# EAGLE design Rev A (EAGLE 6.5.0)

## Sheet 1 of 2
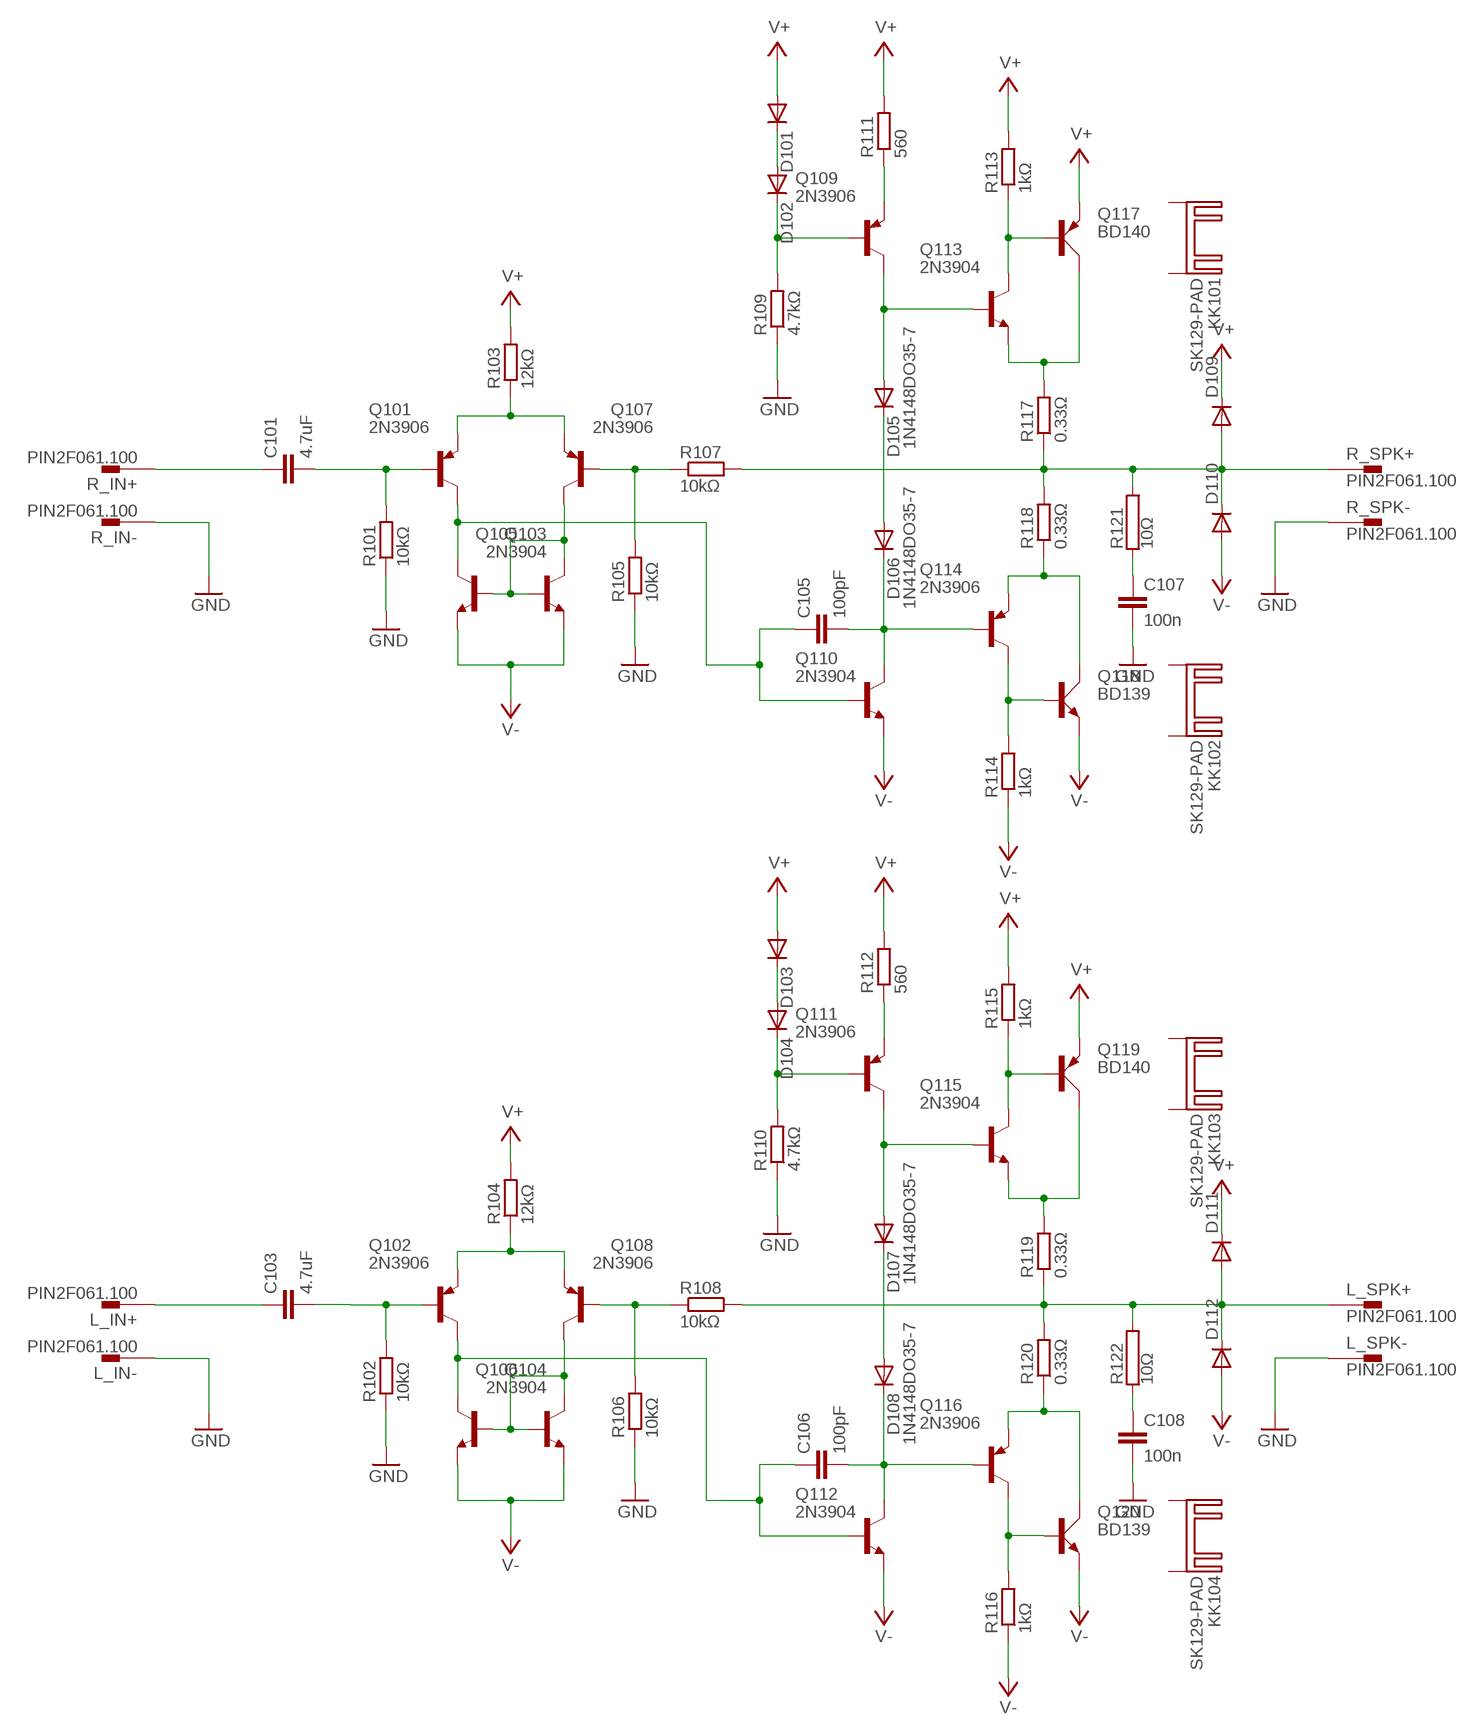
[diagram p0: schematic, sheet 1]

### Parts
C101  4.7uF  C-EU225-113X268  [C225-113X268]
C103  4.7uF  C-EU225-113X268  [C225-113X268]
C105  100pF  C-EU050-050X075  [C050-050X075]
C106  100pF  C-EU050-050X075  [C050-050X075]
C107  100n  C-EU075-042X103  [C075-042X103]
C108  100n  C-EU075-042X103  [C075-042X103]
D101  1N4148DO35-7  [DO35-7]
D102  1N4148DO35-7  [DO35-7]
D103  1N4148DO35-7  [DO35-7]
D104  1N4148DO35-7  [DO35-7]
D105  1N4148DO35-7  [DO35-7]
D106  1N4148DO35-7  [DO35-7]
D107  1N4148DO35-7  [DO35-7]
D108  1N4148DO35-7  [DO35-7]
D109  1N4148DO35-7  [DO35-7]
D110  1N4148DO35-7  [DO35-7]
D111  1N4148DO35-7  [DO35-7]
D112  1N4148DO35-7  [DO35-7]
KK101  SK129-PAD  [SK129]
KK102  SK129-PAD  [SK129]
KK103  SK129-PAD  [SK129]
KK104  SK129-PAD  [SK129]
L_IN+  PIN2F061.100  [F061.100]
L_IN-  PIN2F061.100  [F061.100]
L_SPK+  PIN2F061.100  [F061.100]
L_SPK-  PIN2F061.100  [F061.100]
Q101  2N3906  [TO92]
Q102  2N3906  [TO92]
Q103  2N3904  [TO92]
Q104  2N3904  [TO92]
Q105  2N3904  [TO92]
Q106  2N3904  [TO92]
Q107  2N3906  [TO92]
Q108  2N3906  [TO92]
Q109  2N3906  [TO92]
Q110  2N3904  [TO92]
Q111  2N3906  [TO92]
Q112  2N3904  [TO92]
Q113  2N3904  [TO92]
Q114  2N3906  [TO92]
Q115  2N3904  [TO92]
Q116  2N3906  [TO92]
Q117  BD140  [TO126AV]
Q118  BD139  [TO126AV]
Q119  BD140  [TO126AV]
Q120  BD139  [TO126AV]
R101  10kΩ  R-EU_0207/10  [0207/10]
R102  10kΩ  R-EU_0207/10  [0207/10]
R103  12kΩ  R-EU_0207/10  [0207/10]
R104  12kΩ  R-EU_0207/10  [0207/10]
R105  10kΩ  R-EU_0207/10  [0207/10]
R106  10kΩ  R-EU_0207/10  [0207/10]
R107  10kΩ  R-EU_0207/10  [0207/10]
R108  10kΩ  R-EU_0207/10  [0207/10]
R109  4.7kΩ  R-EU_0207/10  [0207/10]
R110  4.7kΩ  R-EU_0207/10  [0207/10]
R111  560  R-EU_0207/10  [0207/10]
R112  560  R-EU_0207/10  [0207/10]
R113  1kΩ  R-EU_0207/10  [0207/10]
R114  1kΩ  R-EU_0207/10  [0207/10]
R115  1kΩ  R-EU_0207/10  [0207/10]
R116  1kΩ  R-EU_0207/10  [0207/10]
R117  0.33Ω  R-EU_0309/12  [0309/12]
R118  0.33Ω  R-EU_0309/12  [0309/12]
R119  0.33Ω  R-EU_0309/12  [0309/12]
R120  0.33Ω  R-EU_0309/12  [0309/12]
R121  10Ω  RMNS-5  [MNS-5]
R122  10Ω  RMNS-5  [MNS-5]
R_IN+  PIN2F061.100  [F061.100]
R_IN-  PIN2F061.100  [F061.100]
R_SPK+  PIN2F061.100  [F061.100]
R_SPK-  PIN2F061.100  [F061.100]

### Nets
GND: C107.2 C108.2 L_IN-.A1 L_IN-.A2 L_SPK-.A1 L_SPK-.A2 R101.1 R102.1 R105.1 R106.1 R109.1 R110.1 R_IN-.A1 R_IN-.A2 R_SPK-.A1 R_SPK-.A2 ; also sheet 2
L_OUT: D111.A D112.C L_SPK+.A1 L_SPK+.A2 R108.2 R119.1 R120.2 R122.2
N$1: D105.A Q109.1(C) Q113.2(B)
N$2: Q101.3(E) Q107.3(E) R103.1
N$3: Q103.2(B) Q105.1(C) Q105.2(B) Q107.1(C)
N$4: Q104.2(B) Q106.1(C) Q106.2(B) Q108.1(C)
N$5: C101.2 Q101.2(B) R101.2
N$6: D102.C Q109.2(B) R109.2
N$7: C101.1 R_IN+.A1 R_IN+.A2
N$8: C105.1 Q101.1(C) Q103.1(C) Q110.2(B)
N$9: D101.C D102.A
N$11: Q109.3(E) R111.1
N$12: D104.C Q111.2(B) R110.2
N$13: D103.C D104.A
N$14: Q111.3(E) R112.1
N$15: C103.1 L_IN+.A1 L_IN+.A2
N$16: C107.1 R121.1
N$17: C108.1 R122.1
N$24: D105.C D106.A
N$25: C103.2 Q102.2(B) R102.2
N$26: Q113.1(C) Q117.B R113.1
N$27: Q114.1(C) Q118.B R114.2
N$28: Q114.3(E) Q118.C R118.1
N$29: Q113.3(E) Q117.C R117.2
N$31: C105.2 D106.C Q110.1(C) Q114.2(B)
N$32: Q107.2(B) R105.2 R107.1
N$33: Q102.3(E) Q108.3(E) R104.1
N$34: C106.1 Q102.1(C) Q104.1(C) Q112.2(B)
N$35: D107.C D108.A
N$36: D107.A Q111.1(C) Q115.2(B)
N$37: Q115.1(C) Q119.B R115.1
N$38: Q115.3(E) Q119.C R119.2
N$39: Q116.1(C) Q120.B R116.2
N$40: Q116.3(E) Q120.C R120.1
N$41: C106.2 D108.C Q112.1(C) Q116.2(B)
N$42: Q108.2(B) R106.2 R108.1
R_OUT: D109.A D110.C R107.2 R117.1 R118.2 R121.2 R_SPK+.A1 R_SPK+.A2
V+: D101.A D103.A D109.C D111.C Q117.E Q119.E R103.2 R104.2 R111.2 R112.2 R113.2 R115.2 ; also sheet 2
V-: D110.A D112.A Q103.3(E) Q104.3(E) Q105.3(E) Q106.3(E) Q110.3(E) Q112.3(E) Q118.E Q120.E R114.1 R116.1 ; also sheet 2
Unconnected: KK101.A2,5(K) KK101.B2,5(K) KK102.A2,5(K) KK102.B2,5(K) KK103.A2,5(K) KK103.B2,5(K) KK104.A2,5(K) KK104.B2,5(K)

## Sheet 2 of 2
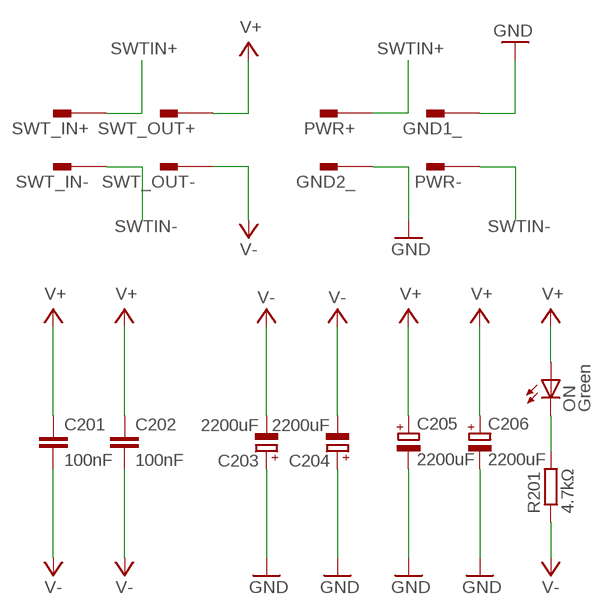
[diagram p1: schematic, sheet 2]

### Parts
C201  100nF  C-EU025-025X050  [C025-025X050]
C202  100nF  C-EU025-025X050  [C025-025X050]
C203  2200uF  CPOL-EUE5-10.5  [E5-10,5]
C204  2200uF  CPOL-EUE5-10.5  [E5-10,5]
C205  2200uF  CPOL-EUE5-10.5  [E5-10,5]
C206  2200uF  CPOL-EUE5-10.5  [E5-10,5]
GND1_  PIN2F061.100  [F061.100]
GND2_  PIN2F061.100  [F061.100]
ON  Green  LED5MM  [LED5MM]
PWR+  PIN2F061.100  [F061.100]
PWR-  PIN2F061.100  [F061.100]
R201  4.7kΩ  R-EU_0207/10  [0207/10]
SWT_IN+  PIN2F061.100  [F061.100]
SWT_IN-  PIN2F061.100  [F061.100]
SWT_OUT+  PIN2F061.100  [F061.100]
SWT_OUT-  PIN2F061.100  [F061.100]

### Nets
GND: C203.+ C204.+ C205.- C206.- GND1_.A1 GND1_.A2 GND2_.A1 GND2_.A2 ; also sheet 1
N$10: ON.K(C) R201.2
SWTIN+: PWR+.A1 PWR+.A2 SWT_IN+.A1 SWT_IN+.A2
SWTIN-: PWR-.A1 PWR-.A2 SWT_IN-.A1 SWT_IN-.A2
V+: C201.1 C202.1 C205.+ C206.+ ON.A SWT_OUT+.A1 SWT_OUT+.A2 ; also sheet 1
V-: C201.2 C202.2 C203.- C204.- R201.1 SWT_OUT-.A1 SWT_OUT-.A2 ; also sheet 1

## Library data of the parts
C101 C103 C105-C108 C201 C202 = rcl:C-EU: CAPACITOR, European symbol
C203-C206 = rcl:CPOL-EU: POLARIZED CAPACITOR, European symbol
D101-D112 = diode:1N4148: DIODE high speed (Philips)
GND1_ GND2_ L_IN+ L_IN- L_SPK+ L_SPK- PWR+ PWR- R_IN+ R_IN- R_SPK+ R_SPK- SWT_IN+ SWT_IN- SWT_OUT+ SWT_OUT- = con-faston:PIN2: Flachstecker Typ Tyco/Electronics/AMP TAB, FASTON Printed Circuit Board Tabs Source: http://www.buerklin.com, http://catalog.tycoelectronics.com; OC_FARNELL: unknown; OC_NEWARK: unknown
KK101-KK104 = heatsink:SK129-PAD: HEATSINK manufacturer Fischer/distributor Buerklin
ON = led:LED: LED OSRAM: - CHIPLED LG R971, LG N971, LY N971, LG Q971, LY Q971, LO R971, LY R971 LH N974, LH R974 LS Q976, LO Q976, LY Q976 LO Q996 - Hyper CHIPLED LW Q18S LB Q993, LB Q99A, LB R99A - SideLED LS A670, LO A670, LY A670, LG A670, LP A670 LB A673, LV A673, LT A673, LW A673 LH A674 LY A675 LS A676, LA A676, LO A676, LY A676, LW A676 LS A679, LY A679, LG A679 - Hyper Micro SIDELED® LS Y876, LA Y876, LO Y876, LY Y876 LT Y87S - SmartLED LW L88C, LW L88S LB L89C, LB L89S, LG L890 LS L89K, LO L89K, LY L89K LS L896, LA L896, LO L896, LY L896 - TOPLED LS T670, LO T670, LY T670, LG T670, LP T670 LSG T670, LSP T670, LSY T670, LOP T670, LYG T670 LG T671, LOG T671, LSG T671 LB T673, LV T673, LT T673, LW T673 LH T674 LS T676, LA T676, LO T676, LY T676, LB T676, LH T676, LSB T676, LW T676 LB T67C, LV T67C, LT T67C, LS T67K, LO T67K, LY T67K, LW E67C LS E67B, LA E67B, LO E67B, LY E67B, LB E67C, LV E67C, LT E67C LW T67C LS T679, LY T679, LG T679 LS T770, LO T770, LY T770, LG T770, LP T770 LB T773, LV T773, LT T773, LW T773 LH T774 LS E675, LA E675, LY E675, LS T675 LS T776, LA T776, LO T776, LY T776, LB T776 LHGB T686 LT T68C, LB T68C - Hyper Mini TOPLED® LB M676 - Mini TOPLED Santana® LG M470 LS M47K, LO M47K, LY M47K Source: http://www.osram.convergy.de LUXEON: - LUMILED® LXK2-PW12-R00, LXK2-PW12-S00, LXK2-PW14-U00, LXK2-PW14-V00 LXK2-PM12-R00, LXK2-PM12-S00, LXK2-PM14-U00 LXK2-PE12-Q00, LXK2-PE12-R00, LXK2-PE12-S00, LXK2-PE14-T00, LXK2-PE14-U00 LXK2-PB12-K00, LXK2-PB12-L00, LXK2-PB12-M00, LXK2-PB14-N00, LXK2-PB14-P00, LXK2-PB14-Q00 LXK2-PR12-L00, LXK2-PR12-M00, LXK2-PR14-Q00, LXK2-PR14-R00 LXK2-PD12-Q00, LXK2-PD12-R00, LXK2-PD12-S00 LXK2-PH12-R00, LXK2-PH12-S00 LXK2-PL12-P00, LXK2-PL12-Q00, LXK2-PL12-R00 Source: www.luxeon.com KINGBRIGHT: KA-3528ASYC Source: www.kingbright.com
Q101 Q102 Q107-Q109 Q111 Q114 Q116 = transistor-pnp:2N3906: PNP Transistor
Q103-Q106 Q110 Q112 Q113 Q115 = transistor-npn:2N3904: NPN Transistor
Q117 Q119 = transistor-power:BD140: PNP TRANSISTOR
Q118 Q120 = transistor-power:BD139: NPN TRANSISTOR
R101-R120 R201 = rcl:R-EU_: RESISTOR, European symbol
R121 R122 = resistor-power:R: Power Resitor; OC_FARNELL: unknown; OC_NEWARK: unknown

## Board
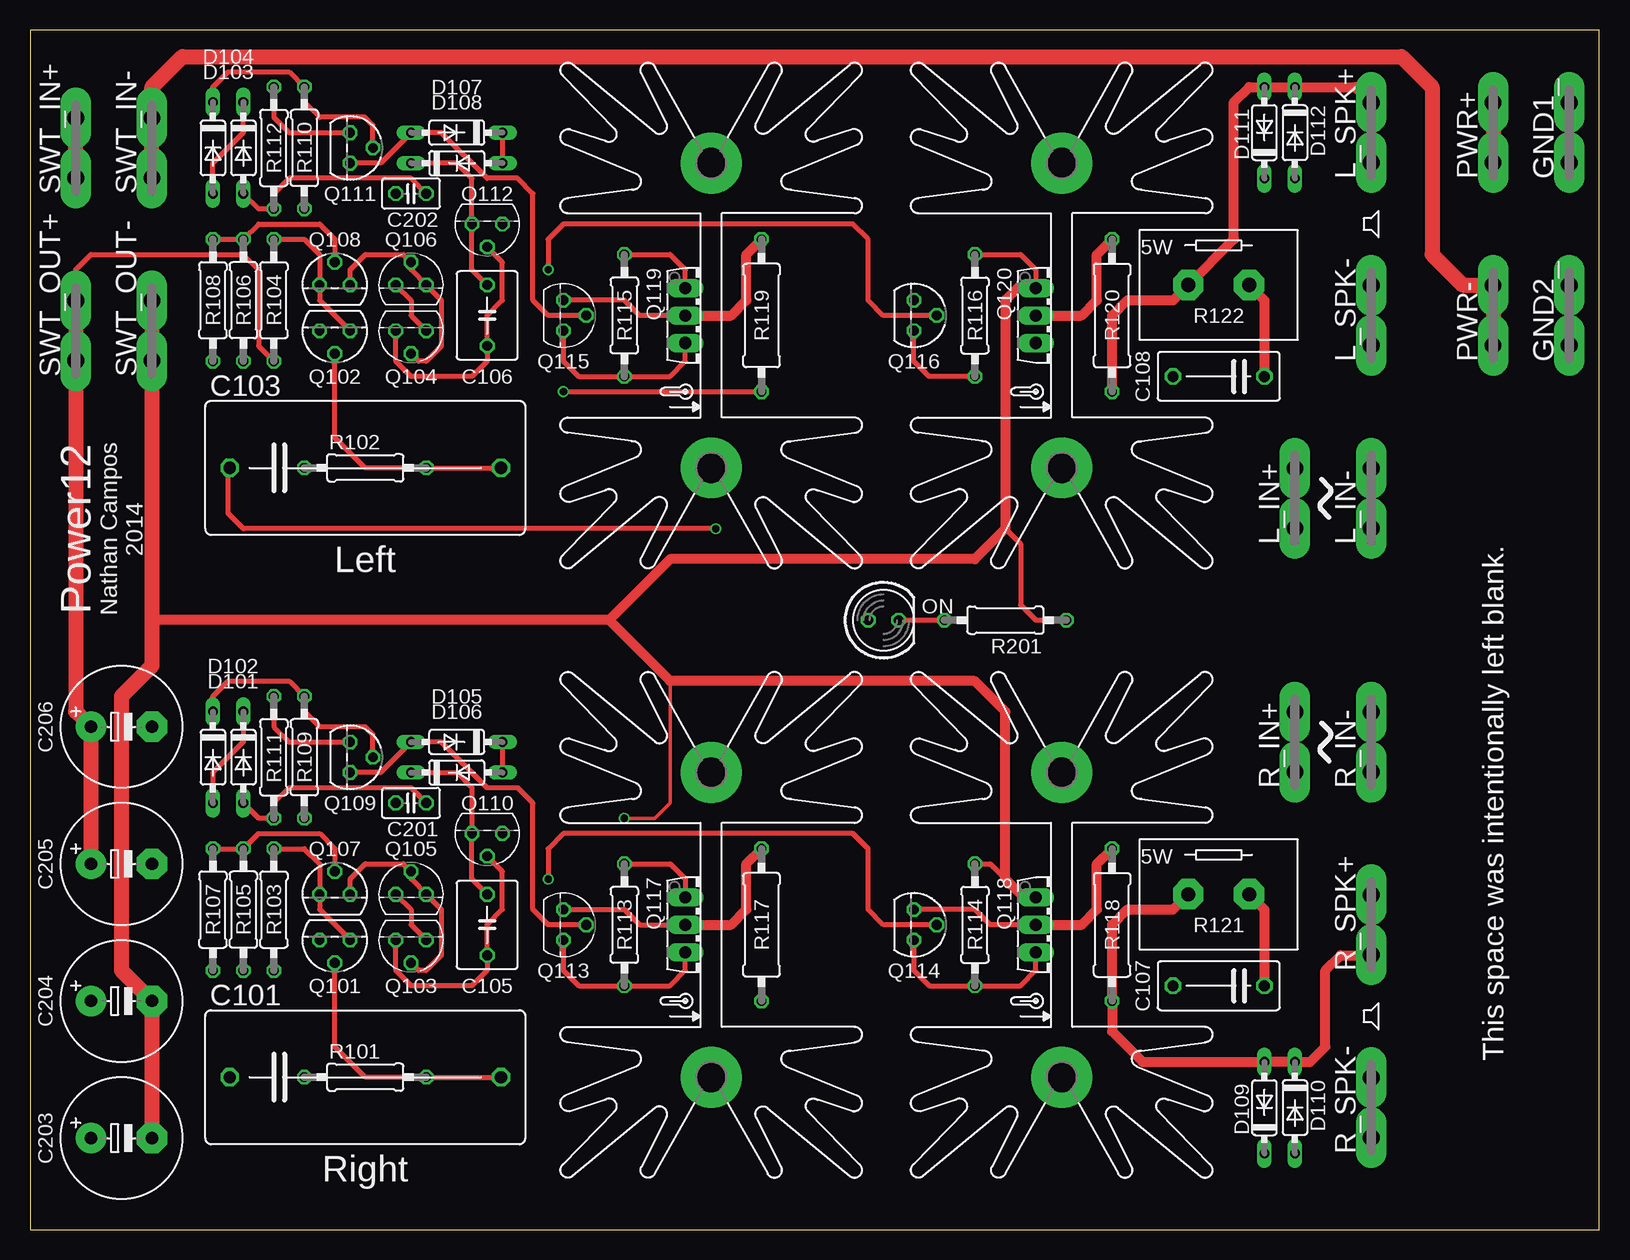
[diagram p2: board, top side]
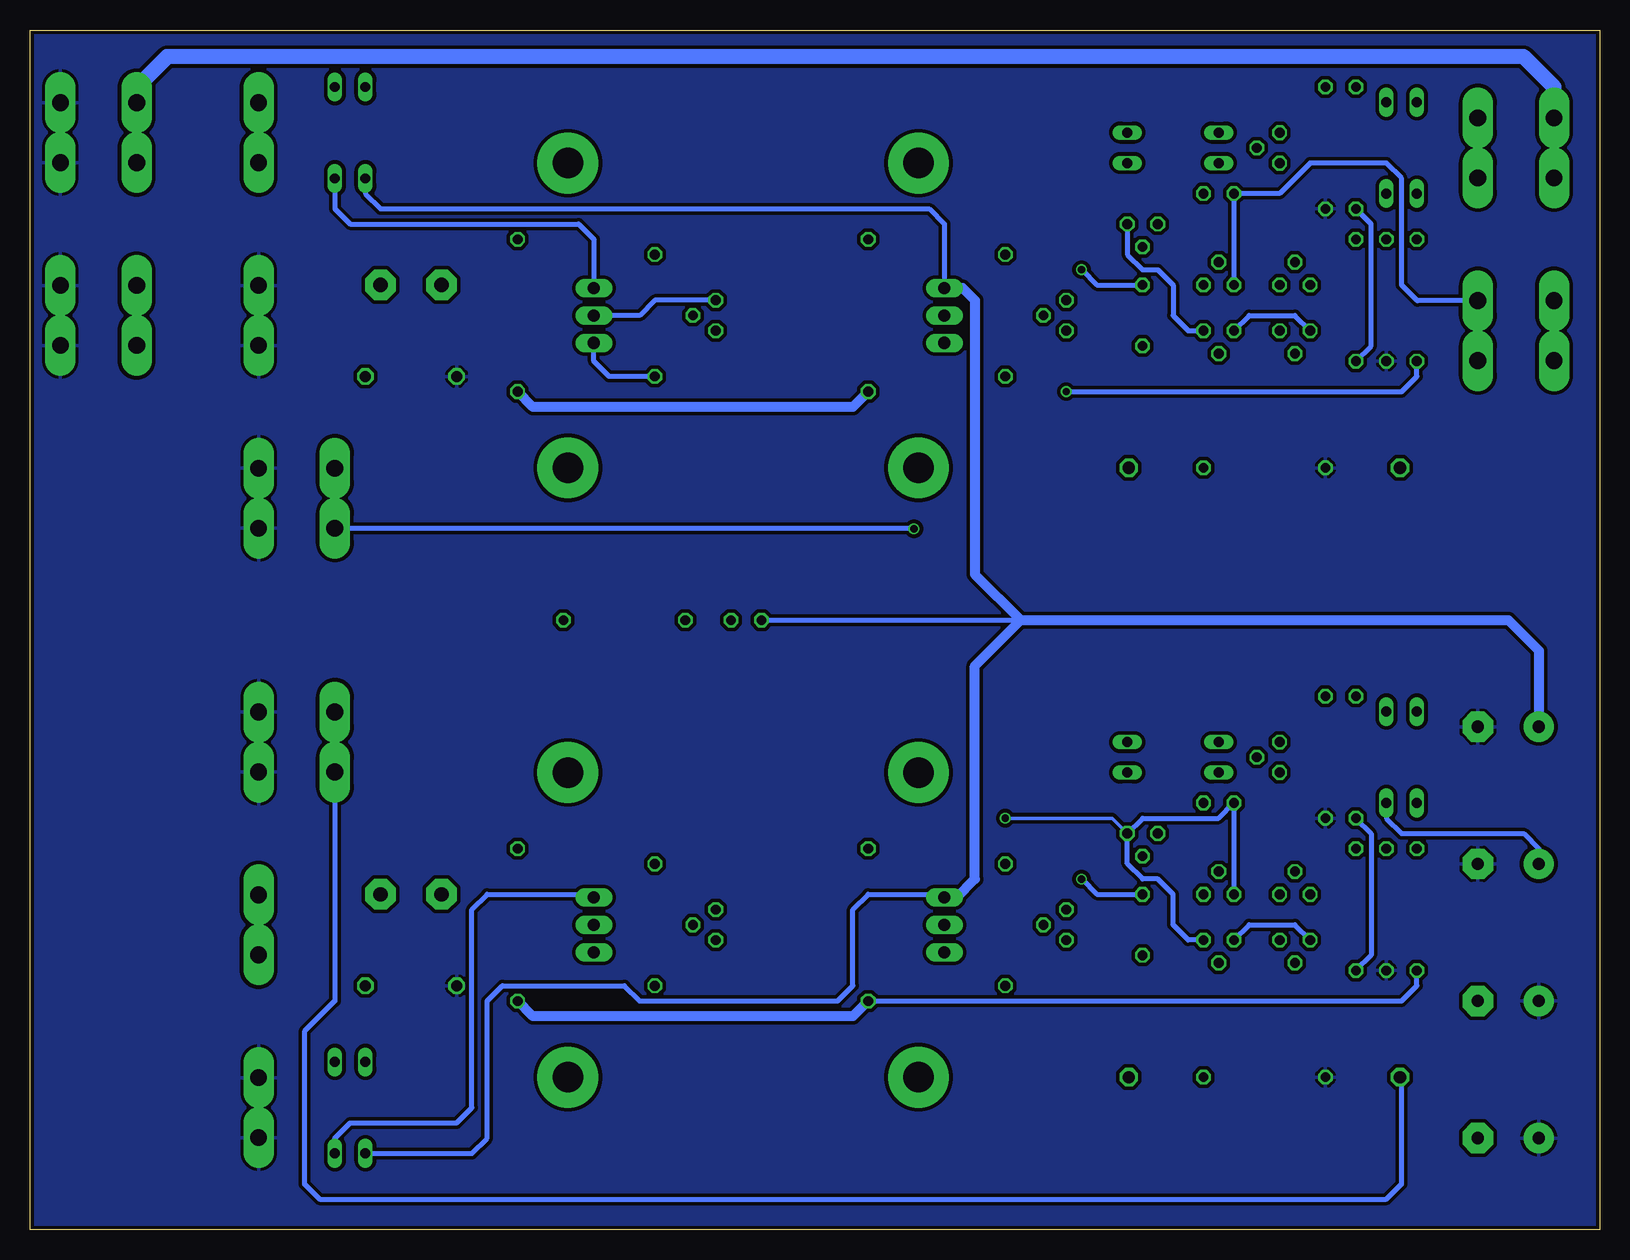
[diagram p3: board, bottom side, seen from below]

Size 130.79 x 100 mm. Coordinates in mm from the lower left corner, seen from the top.
Outline: 0,0 130.79,0 130.79,100 0,100 0,0
Copper layers (1*2*15*16): Top 0.035mm / dielectric 0.2mm / Route2 0.0175mm / dielectric 1.1mm / Route15 0.0175mm / dielectric 0.2mm / Bottom 0.035mm
Design rules "SeeedStudio_DRU_no_angle_20130527": minimum track width 6mil, minimum drill 12mil, track to track 6mil, track to pad 6mil, pad to pad 6mil, via to via 6mil, smd to smd 0mil, copper to edge 10mil, drill to drill 10mil, minimum pad ring 6mil, minimum via ring 6mil, stop-mask expansion 2mil, vias tented up to drill 25mil, thermal gap 10mil

### Footprints (pad centres in the part's own frame; a part is rotated, then mirrored left to right if it is on the bottom)
C225-113X268 = drill 1.016 octagon: 1 -11.303,0; 2 11.303,0
C050-050X075 = drill 0.813 octagon: 1 -2.54,0; 2 2.54,0
C075-042X103 = drill 0.914 octagon: 1 -3.81,0; 2 3.81,0
C025-025X050 = drill 0.813 octagon: 1 -1.27,0; 2 1.27,0
E5-10,5 = drill 1.016 pad 2.54: + -2.54,0 | drill 1.016 pad 2.54 octagon: - 2.54,0
DO35-7 = drill 0.813 long: A 3.81,0; C -3.81,0
F061.100 = drill 1.4 pad 2.54 long: A1 -2.5,0; A2 2.5,0
SK129 = drill 2.54 pad 5.08: A2,5 -12.7,-0.889; B2,5 12.7,-0.889
LED5MM = drill 0.813 octagon: A -1.27,0; K 1.27,0
TO92 = drill 0.813 octagon: 1 1.27,0; 2 0,1.905; 3 -1.27,0
TO126AV = drill 1.016 long: B 2.286,-1.27; C 0,-1.27; E -2.286,-1.27
0207/10 = drill 0.813 octagon: 1 -5.08,0; 2 5.08,0
0309/12 = drill 0.813 octagon: 1 -6.35,0; 2 6.35,0
MNS-5 = drill 1.194 pad 2.54 octagon: 1 -2.54,0; 2 2.54,0

### Placement (x,y rotation side)
C101  27.94,12.7 0 top
C103  27.94,63.5 0 top
C105  38.1,25.4 90 top
C106  38.1,76.2 90 top
C107  99.06,20.32 180 top
C108  99.06,71.12 180 top
C201  31.75,35.56 180 top
C202  31.75,86.36 180 top
C203  7.62,7.62 0 top
C204  7.62,19.05 0 top
C205  7.62,30.48 0 top
C206  7.62,41.91 0 top
D101  17.78,39.37 270 top
D102  15.24,39.37 270 top
D103  17.78,90.17 270 top
D104  15.24,90.17 270 top
D105  35.56,40.64 180 top
D106  35.56,38.1 0 top
D107  35.56,91.44 180 top
D108  35.56,88.9 0 top
D109  102.87,10.16 90 top
D110  105.41,10.16 270 top
D111  102.87,91.44 90 top
D112  105.41,91.44 270 top
GND1_  128.27,91.44 90 top
GND2_  128.27,76.2 90 top
KK101  85.09,76.2 90 top
KK102  55.88,76.2 90 top
KK103  85.09,25.4 90 top
KK104  55.88,25.4 90 top
L_IN+  105.41,60.96 90 top
L_IN-  111.76,60.96 90 top
L_SPK+  111.76,91.44 90 top
L_SPK-  111.76,76.2 90 top
ON  71.12,50.8 0 top
PWR+  121.92,91.44 90 top
PWR-  121.92,76.2 90 top
Q101  25.4,24.13 180 top
Q102  25.4,74.93 180 top
Q103  31.75,24.13 180 top
Q104  31.75,74.93 180 top
Q105  31.75,27.94 0 top
Q106  31.75,78.74 0 top
Q107  25.4,27.94 0 top
Q108  25.4,78.74 0 top
Q109  26.67,39.37 270 top
Q110  38.1,33.02 180 top
Q111  26.67,90.17 270 top
Q112  38.1,83.82 180 top
Q113  44.45,25.4 270 top
Q114  73.66,25.4 270 top
Q115  44.45,76.2 270 top
Q116  73.66,76.2 270 top
Q117  55.88,25.4 270 top
Q118  85.09,25.4 270 top
Q119  55.88,76.2 270 top
Q120  85.09,76.2 270 top
R101  27.94,12.7 0 top
R102  27.94,63.5 0 top
R103  20.32,26.67 270 top
R104  20.32,77.47 270 top
R105  17.78,26.67 90 top
R106  17.78,77.47 90 top
R107  15.24,26.67 270 top
R108  15.24,77.47 270 top
R109  22.86,39.37 90 top
R110  22.86,90.17 90 top
R111  20.32,39.37 270 top
R112  20.32,90.17 270 top
R113  49.53,25.4 90 top
R114  78.74,25.4 270 top
R115  49.53,76.2 90 top
R116  78.74,76.2 270 top
R117  60.96,25.4 90 top
R118  90.17,25.4 270 top
R119  60.96,76.2 90 top
R120  90.17,76.2 270 top
R121  99.06,27.94 180 top
R122  99.06,78.74 180 top
R201  81.28,50.8 180 top
R_IN+  105.41,40.64 90 top
R_IN-  111.76,40.64 90 top
R_SPK+  111.76,25.4 90 top
R_SPK-  111.76,10.16 90 top
SWT_IN+  3.81,90.17 90 top
SWT_IN-  10.16,90.17 90 top
SWT_OUT+  3.81,74.93 90 top
SWT_OUT-  10.16,74.93 90 top
U$1  [ICON_SPEAKER]  111.76,17.78 0 top
U$2  [ICON_SPEAKER]  111.76,83.82 0 top
U$3  [ICON_TEMP]  83.82,69.85 90 top
U$4  [ICON_TEMP]  54.61,69.85 90 top
U$5  [ICON_TEMP]  83.82,19.05 90 top
U$6  [ICON_TEMP]  54.61,19.05 90 top
U$7  [ICON_AC]  107.95,40.64 90 top
U$8  [ICON_AC]  107.95,60.96 90 top

### Tracks (layer width: path | path; a pad name or v marks a point on that pad's centre or on a via)
GND
  pour Bottom (isolate 0.305): 0,100.33 130.81,100.33 130.81,0 0,0
L_OUT  (via drill 0.6)
  Top 0.406: v44.45,69.85 R119.1
  Top 0.813: R120.2 90.17,76.2 91.44,77.47 95.25,77.47 R122.2 100.33,82.55 100.33,93.98 101.6,95.25 D111.A D112.C 110.45,95.25 L_SPK+.A2 L_SPK+.A1
  Bottom 0.406: v44.45,69.85 16.51,69.85 15.24,71.12 R108.2
  Bottom 0.813: R119.1 62.23,68.58 88.9,68.58 R120.2
N$1
  Top 0.406: Q109.1 29.21,38.1 D105.A 34.29,40.64 38.1,36.83 40.64,36.83 41.91,35.56 41.91,26.67 43.18,25.4 Q113.2
N$2
  Top 0.406: R103.1 22.86,31.75 24.13,30.48 Q107.3 24.13,26.67 Q101.3
N$3
  Top 0.406: Q107.1 26.67,29.21 27.94,30.48 31.11,30.48 Q105.2 31.75,29.21 Q105.1 34.29,26.67 34.29,22.86 33.02,21.59 32.38,21.59 Q103.2
N$4
  Top 0.406: Q108.1 26.67,80.01 27.94,81.28 31.11,81.28 Q106.2 31.75,80.01 Q106.1 34.29,77.47 34.29,73.66 33.02,72.39 32.38,72.39 Q104.2
N$5
  Top 0.406: C101.2 R101.2 27.94,12.7 25.4,15.24 Q101.2
N$6
  Top 0.406: D102.C 15.24,44.45 16.51,45.72 21.59,45.72 R109.2 22.86,43.18 24.13,41.91 27.94,41.91 28.57,41.27 Q109.2
N$7
  Top 0.406: R_IN+.A2 R_IN+.A1
  Bottom 0.406: R_IN+.A1 105.41,19.05 107.95,16.51 107.95,3.81 106.68,2.54 17.78,2.54 16.51,3.81 16.51,12.57 C101.1
N$8
  Top 0.406: Q103.1 30.48,21.59 31.75,20.32 36.83,20.32 38.1,21.59 C105.1 38.1,25.4 39.37,26.67 39.37,29.84 Q110.2
  Bottom 0.406: Q103.1 29.21,25.4 25.4,25.4 Q101.1
N$9
  Top 0.406: D101.C 17.78,40.64 15.24,38.1 D102.A
N$10
  Top 0.406: ON.K R201.2
N$11
  Top 0.406: R111.1 20.32,41.91 21.59,40.64 Q109.3
N$12
  Top 0.406: D104.C 15.24,95.25 16.51,96.52 21.59,96.52 R110.2 22.86,93.98 24.13,92.71 27.94,92.71 28.57,92.08 Q111.2
N$13
  Top 0.406: D104.A 15.24,88.9 17.78,91.44 D103.C
N$14
  Top 0.406: R112.1 20.32,92.71 21.59,91.44 Q111.3
N$15  (via drill 0.6)
  Top 0.406: v57.15,58.42 17.78,58.42 16.51,59.69 16.51,63.37 C103.1 | L_IN+.A2 L_IN+.A1
  Bottom 0.406: L_IN+.A1 57.19,58.46 v57.15,58.42
N$16
  Top 0.813: R121.1 102.87,26.67 C107.1
N$17
  Top 0.813: R122.1 102.87,77.47 C108.1
N$24
  Top 0.406: D105.C D106.A
N$25
  Top 0.406: C103.2 R102.2 27.94,63.5 25.4,66.04 Q102.2
N$26
  Top 0.406: Q117.B 54.61,21.59 53.34,20.32 R113.1 45.72,20.32 44.45,21.59 Q113.1
N$27
  Top 0.406: Q114.1 73.66,21.59 74.93,20.32 R114.2 82.55,20.32 83.82,21.59 Q118.B
N$28
  Top 0.406: Q118.C 80.01,25.4 78.74,26.67 Q114.3
  Top 0.813: Q118.C 87.63,25.4 88.9,26.67 88.9,30.48 R118.1
N$29
  Top 0.406: Q113.3 49.53,26.67 50.8,25.4 Q117.C
  Top 0.813: Q117.C 58.42,25.4 59.69,26.67 59.69,30.48 R117.2
N$31  (via drill 0.6)
  Top 0.406: C105.2 36.83,29.21 Q110.1 36.83,36.83 35.56,38.1 D106.C | Q114.2 71.12,25.4 69.85,26.67 69.85,31.75 68.58,33.02 44.45,33.02 43.18,31.75 v43.18,29.21
  Bottom 0.406: v43.18,29.21 41.91,27.94 C105.2
N$32
  Top 0.406: Q107.2 25.4,31.75 24.13,33.02 19.05,33.02 R105.2 R107.1
N$33
  Top 0.406: R104.1 22.86,82.55 24.13,81.28 Q108.3 24.13,77.47 Q102.3
N$34
  Top 0.406: Q104.1 30.48,72.39 31.75,71.12 36.83,71.12 38.1,72.39 C106.1 38.1,76.2 39.37,77.47 39.37,80.64 Q112.2
  Bottom 0.406: Q104.1 29.21,76.2 25.4,76.2 Q102.1
N$35
  Top 0.406: D107.C D108.A
N$36
  Top 0.406: Q111.1 29.21,88.9 D107.A 34.29,91.44 38.1,87.63 40.64,87.63 41.91,86.36 41.91,77.47 43.18,76.2 Q115.2
N$37
  Top 0.406: Q119.B 54.61,72.39 53.34,71.12 R115.1 45.72,71.12 44.45,72.39 Q115.1
N$38
  Top 0.406: Q119.C 50.8,76.2 49.53,77.47 Q115.3
  Top 0.813: Q119.C 58.42,76.2 59.69,77.47 59.69,81.28 R119.2
N$39
  Top 0.406: R116.2 74.93,71.12 73.66,72.39 Q116.1
  Bottom 0.406: R116.2 82.55,71.12 83.82,72.39 Q120.B
N$40
  Top 0.813: Q120.C 87.63,76.2 88.9,77.47 88.9,81.28 R120.1
  Bottom 0.406: Q116.3 78.74,77.47 80.01,76.2 Q120.C
N$41  (via drill 0.6)
  Top 0.406: C106.2 36.83,80.01 Q112.1 36.83,87.63 35.56,88.9 D108.C | Q116.2 71.12,76.2 69.85,77.47 69.85,82.55 68.58,83.82 44.45,83.82 43.18,82.55 v43.18,80.01
  Bottom 0.406: v43.18,80.01 41.91,78.74 C106.2
N$42
  Top 0.406: R108.1 R106.2 19.05,83.82 24.13,83.82 25.4,82.55 Q108.2
R_OUT
  Top 0.813: R121.2 95.25,26.67 91.44,26.67 90.17,25.4 R118.2 90.17,16.51 92.71,13.97 D109.A D110.C 106.68,13.97 107.95,15.24 107.95,21.59 109.22,22.86 111.72,22.86 R_SPK+.A1 R_SPK+.A2
  Bottom 0.406: R117.1 16.51,19.05 15.24,20.32 R107.2
  Bottom 0.813: R117.1 62.23,17.78 88.9,17.78 R118.2
SWTIN+
  Top 1.27: SWT_IN+.A1 SWT_IN+.A2 | PWR+.A2 PWR+.A1
  Bottom 1.27: SWT_IN+.A2 3.81,95.25 6.35,97.79 119.38,97.79 121.92,95.25 PWR+.A2
SWTIN-
  Top 1.27: PWR-.A1 PWR-.A2 121.88,78.74 119.38,78.74 116.84,81.28 116.84,95.25 114.3,97.79 12.7,97.79 10.16,95.25 SWT_IN-.A2 SWT_IN-.A1
V+
  Top 0.406: D101.A 19.05,34.29 R111.2 20.32,35.56 21.59,36.83 31.75,36.83 C201.1 | D103.A 19.05,85.09 R112.2 20.32,86.36 21.59,87.63 31.75,87.63 C202.1 | R113.2 53.34,30.48 54.61,29.21 Q117.E | R115.2 53.34,81.28 54.61,80.01 Q119.E | SWT_OUT+.A1 3.81,80.01 5.08,81.28 17.78,81.28 19.05,80.01 19.05,73.66 R104.2
  Top 1.27: C205.+ C206.+ 3.81,43.18 SWT_OUT+.A1 SWT_OUT+.A2
  Bottom 0.406: R111.2 19.05,33.02 19.05,22.86 R103.2 | R104.2 19.05,73.66 19.05,83.82 R112.2 | ON.A 48.26,50.8 | D101.A 17.78,34.29 16.51,33.02 6.35,33.02 5.08,31.75 C205.+ | D111.C 102.87,86.36 101.6,85.09 55.88,85.09 54.61,83.82 Q119.E | D109.C 93.98,6.35 92.71,7.62 92.71,19.05 91.44,20.32 81.28,20.32 80.01,19.05 63.5,19.05 62.23,20.32 62.23,26.67 60.96,27.94 54.86,27.94 Q117.E
  Bottom 0.813: Q119.E 53.09,78.49 52.07,77.47 52.07,54.61 48.26,50.8 | 48.26,50.8 7.62,50.8 5.08,48.26 C206.+ | 48.26,50.8 52.07,46.99 52.07,29.21 53.59,27.69 Q117.E
V-  (via drill 0.6)
  Top 0.305: v49.53,34.29 52.07,34.29 53.34,35.56 53.34,45.72
  Top 0.406: Q106.3 31.75,77.47 31.75,76.2 Q104.3 | Q105.3 31.75,26.67 31.75,25.4 Q103.3 | R116.1 82.55,81.28 83.82,80.01 Q120.E | R114.1 80.01,30.48 81.28,29.21 | 81.28,58.42 82.55,57.15 82.55,52.07 83.82,50.8 R201.1
  Top 0.813: Q120.E 82.3,78.49 81.28,77.47 81.28,58.42 78.74,55.88 53.34,55.88 48.26,50.8 | Q118.E 82.8,27.69 81.28,29.21 81.28,43.18 78.74,45.72 53.34,45.72 48.26,50.8 | 48.26,50.8 10.16,50.8
  Top 1.27: C203.- C204.- 7.62,21.59 7.62,44.45 10.16,46.99 10.16,50.8 SWT_OUT-.A2 SWT_OUT-.A1
  Bottom 0.305: Q110.3 40.64,34.29 v49.53,34.29
  Bottom 0.406: Q103.3 34.29,24.13 35.56,25.4 35.56,27.94 36.83,29.21 38.1,29.21 39.37,30.48 Q110.3 38.1,34.29 31.75,34.29 C201.2 Q105.3 | Q112.3 39.37,81.28 38.1,80.01 36.83,80.01 35.56,78.74 35.56,76.2 34.29,74.93 Q104.3 | Q106.3 C202.2 26.67,86.36 24.13,88.9 17.78,88.9 16.51,87.63 16.51,78.74 15.2,77.43 SWT_OUT-.A2 | D112.A 105.41,85.09 104.14,83.82 85.09,83.82 83.82,82.55 Q120.E | D110.A 105.41,7.62 104.14,8.89 95.25,8.89 93.98,10.16 93.98,26.67 92.71,27.94 84.07,27.94 Q118.E

### Text on the board
tPlace: Power12 | Nathan Campos / 2014 | Left | This space was intentionally left blank. | Right